# EAGLE design SMT Logic Board (DS3232) (EAGLE 9.6.2)
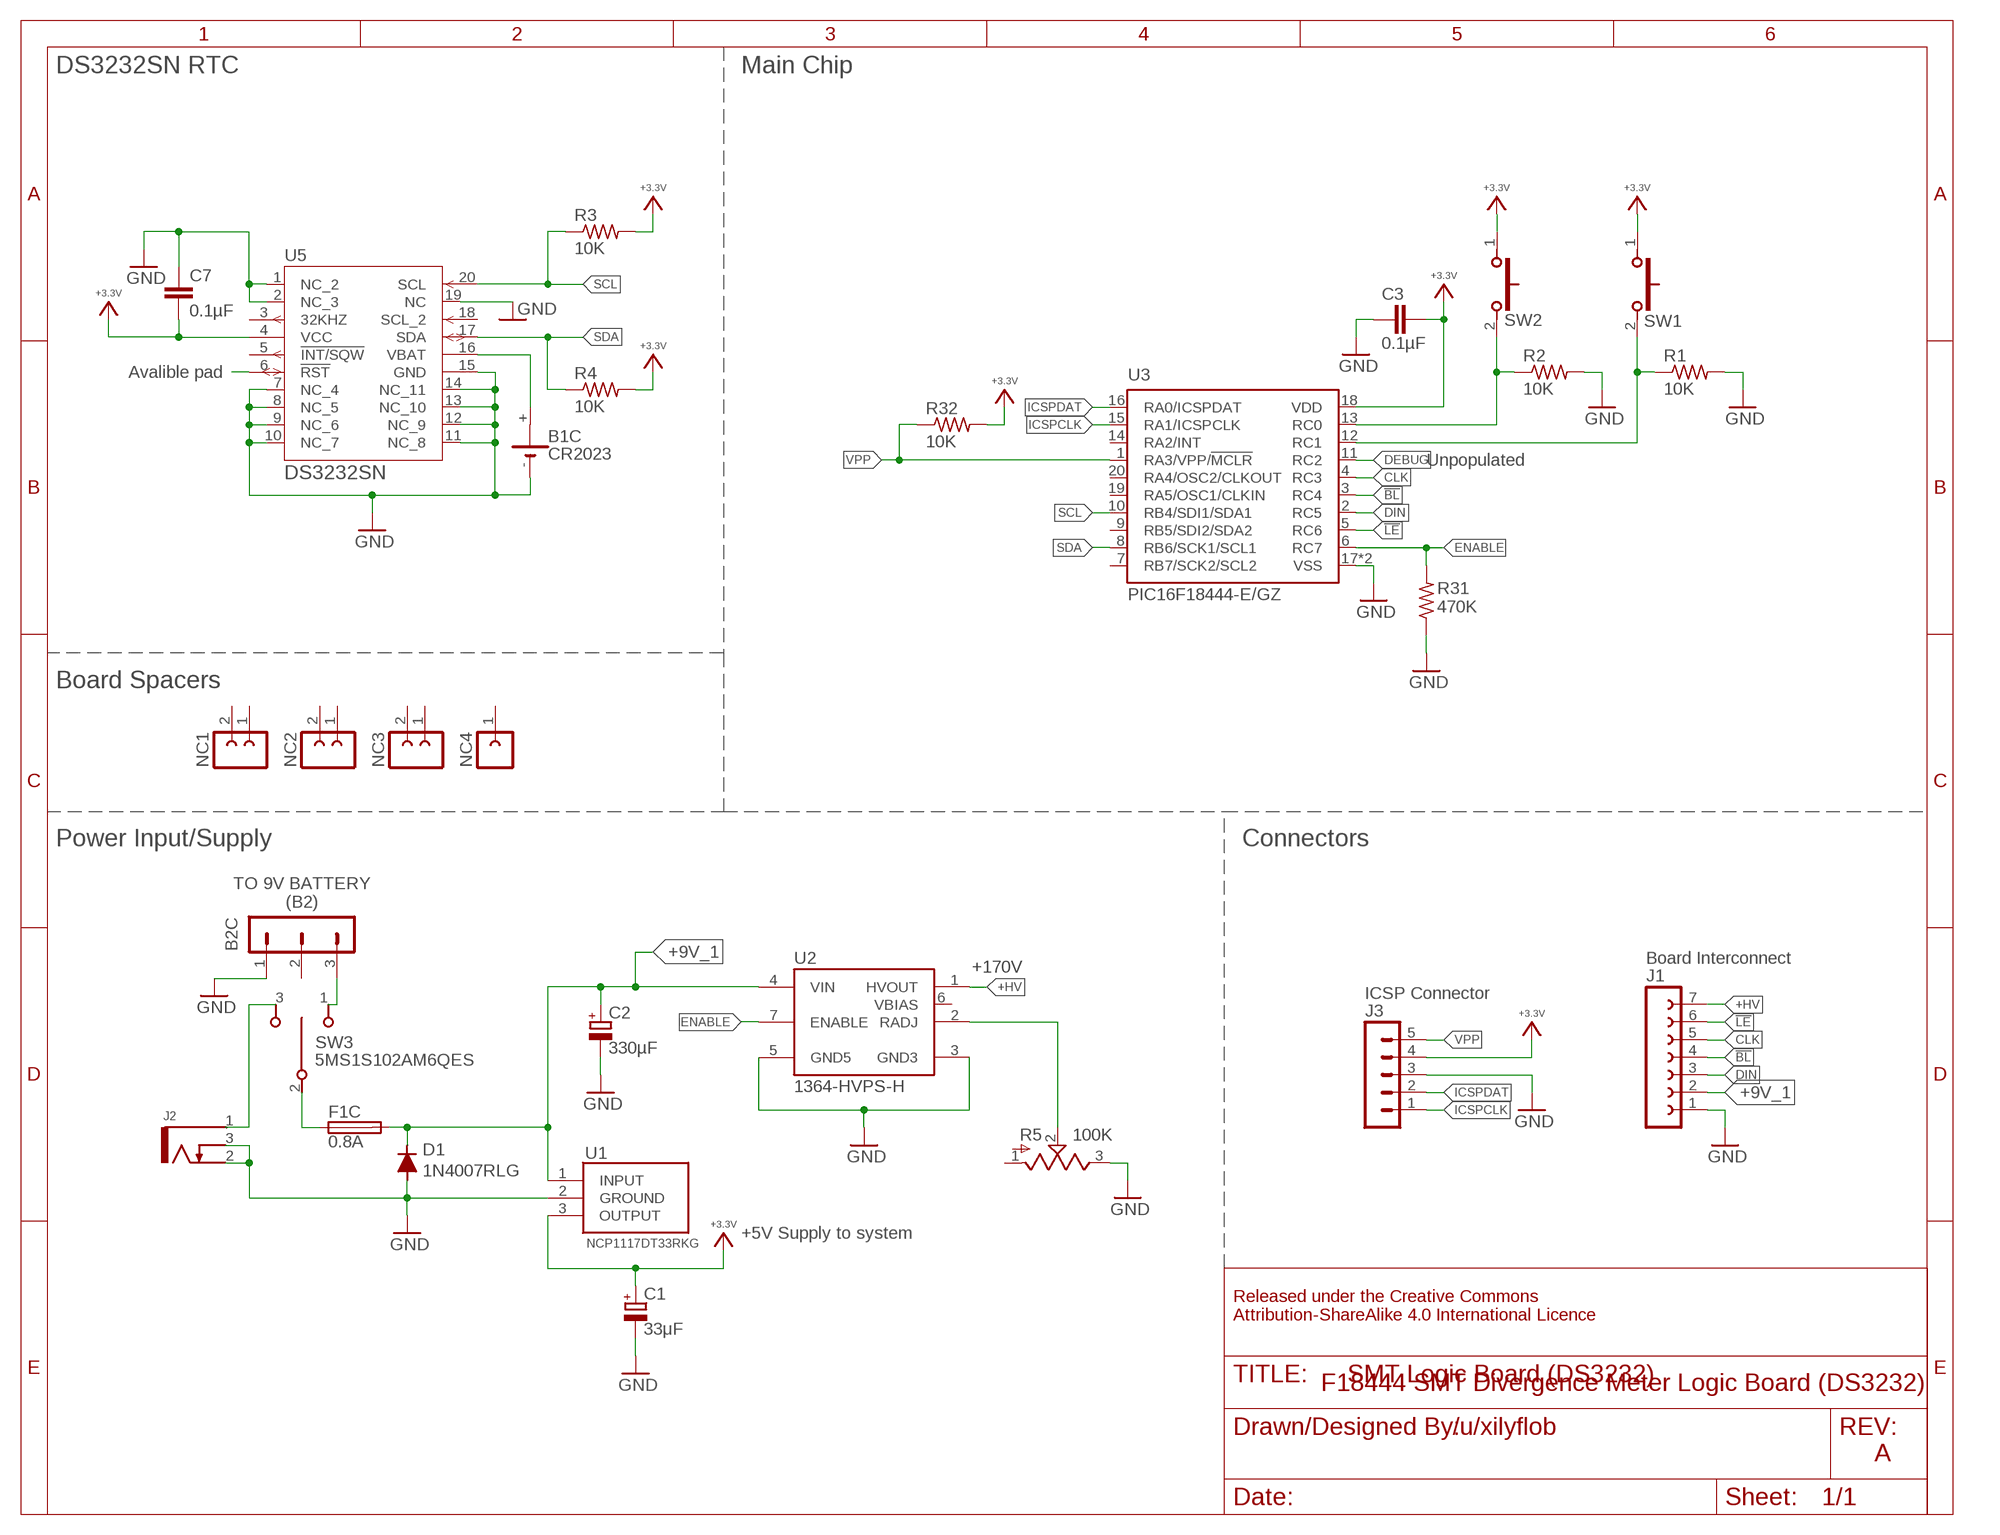
[diagram p0: schematic, sheet 1]

## Parts
B1C  CR2023  BATTERY  [103]
B2C  53253_3P  [532530370]
C1  33μF  CPOL-EU  [4MM_SMD_CHIP]
C2  330µF  CPOL-EU6.3MM_SMD_CHIP  [6.3MM_SMD_CHIP]
C3  0.1µF  C-EU  [C0805]
C7  0.1µF  C-EU  [C0805]
D1  1N4007RLG  RECTIFIERSMA-403D  [SMA-403D]
F1C  0.8A  FUSE  [5X20MM]
J1  FE07FE07  [FE07]
J2  KLDX-0202-B  [KDLX-0202-X]
J3  MA05  [MA05]
NC1  FE02  [FE02]
NC2  FE02  [FE02]
NC3  FE02  [FE02]
NC4  FE01  [FE01]
R1  10K  R-US  [R0805]
R2  10K  R-US  [R0805]
R3  10K  R-US  [R0805]
R4  10K  R-US  [R0805]
R5  100K  R-US_TRIM3224W  [3224W]
R31  470K  R-US  [R0805]
R32  10K  R-US  [R0805]
SW1  FSMRA4JH04  SWITCH_PUSH_SPST_(ON)  [FSMRA4JH]
SW2  FSMRA4JH04  SWITCH_PUSH_SPST_(ON)  [FSMRA4JH]
SW3  5MS1S102AM6QES  SWITCH_SLIDE_SPDT_ON  [SLIDE_SPDT_MINI]
U1  NCP1117DT33RKG  MC7805CTGTO-252-3  [DPAK]
U2  1364-HVPS-H  [1364-HVPS-H]
U3  PIC16F18444-E/GZ  PIC16F184  [UQFN-20]
U5  DS3232SN  [SOIC-20]

## Nets
!BL!: J1.4 U3.3(RC4)
!LE!: J1.6 U3.5(RC6)
+3.3V: C1.+ C3.1 C7.2 J3.4 R3.2 R4.2 R32.2 SW1.1 SW2.1 U1.3(OUTPUT) U3.18(VDD) U5.4(VCC)
+9V: J2.1 SW3.3(POS_2)
+9V_1: C2.+ D1.C F1C.2A F1C.2B J1.2 U1.1(INPUT) U2.4(VIN)
+9V_2: F1C.1A F1C.1B SW3.2(COM)
+9V_3: B2C.3 SW3.1(POS_1)
+HV: J1.7 U2.1(HVOUT)
BAT: B1C.+ U5.16(VBAT)
CLK: J1.5 U3.4(RC3)
CLK_RST: U5.6(!RST)
DEBUG: U3.11(RC2)
DIN: J1.3 U3.2(RC5)
ENABLE: R31.2 U2.7(ENABLE) U3.6(RC7)
GND: B1C.- B2C.1 C1.- C2.- C3.2 C7.1 D1.A J1.1 J2.2 J2.3 J3.3 R1.2 R2.2 R5.3 R31.1 U1.2(GROUND) U2.3(GND3) U2.5(GND5) U3.17(VSS) U3.21(VSS) U5.1(NC_2) U5.2(NC_3) U5.7(NC_4) U5.8(NC_5) U5.9(NC_6) U5.10(NC_7) U5.11(NC_8) U5.12(NC_9) U5.13(NC_10) U5.14(NC_11) U5.15(GND) U5.19(NC)
ICSPCLK: J3.1 U3.15(RA1/ICSPCLK)
ICSPDAT: J3.2 U3.16(RA0/ICSPDAT)
RADJ: R5.2 U2.2(RADJ)
SCL: R3.1 U3.10(RB4/SDI1/SDA1) U5.20(SCL)
SDA: R4.1 U3.8(RB6/SCK1/SCL1) U5.17(SDA)
SW1: R1.1 SW1.2 U3.12(RC1)
SW2: R2.1 SW2.2 U3.13(RC0)
VPP: J3.5 R32.1 U3.1(RA3/VPP/!MCLR!)
Unconnected: B2C.2 NC1.1 NC1.2 NC2.1 NC2.2 NC3.1 NC3.2 NC4.1 R5.1 U2.6(VBIAS) U3.7(RB7/SCK2/SCL2) U3.9(RB5/SDI2/SDA2) U3.14(RA2/INT) U3.19(RA5/OSC1/CLKIN) U3.20(RA4/OSC2/CLKOUT) U5.3(32KHZ) U5.5(!INT/SQW) U5.18(SCL_2)

## Notes on the sheet
- DS3232SN RTC | Main Chip
- Avalible pad
- Unpopulated
- Board Spacers
- Power Input/Supply | Connectors
- TO 9V BATTERY
  (B2)
- Board Interconnect
- +170V
- ICSP Connector
- +5V Supply to system
- Released under the Creative Commons
  Attribution-ShareAlike 4.0 International Licence
- F18444 SMT Divergence Meter Logic Board (DS3232)
- /u/xilyflob
- A

## Library data of the parts
B1C = My Imported Components:BATTERY: LI BATTERY Varta
B2C = My Imported Components:53253_3P: Molex 53253-0370
C1 C2 = My Imported Components:CPOL-EU
C3 C7 = My Imported Components:C-EU
D1 = My Imported Components:RECTIFIER
F1C = My Imported Components:FUSE
J1 = My Imported Components:FE07: FEMALE HEADER
J2 = My Imported Components:KLDX-0202-B: https://www.mouser.com/datasheet/2/222/KLDX_0202-334781.pdf
J3 = My Imported Components:MA05: PIN HEADER
NC1-NC3 = My Imported Components:FE02: FEMALE HEADER
NC4 = My Imported Components:FE01: FEMALE HEADER
R1-R4 R31 R32 = My Imported Components:R-US: RESISTOR, American symbol
R5 = My Imported Components:R-US_TRIM: Res Cermet Trimmer 1M Ohm 10% 1/4W 12(Elec)Turn 1.8mm (6.4 X 4 X 7.7mm) Pin Thru-Hole Bulk Check prices <https://pricing.snapeda.com/parts/PV37W104C01B00/Bourns/view-part?ref=eda>
SW1 SW2 = My Imported Components:SWITCH_PUSH_SPST_(ON)
SW3 = My Imported Components:SWITCH_SLIDE_SPDT_ON
U1 = My Imported Components:MC7805CTG: Voltage regulator,MC7805CT 5V 1A ON Semiconductor MC7805CTG, Single Linear Voltage Regulator, 1A 5 V, +/-4%, 3-Pin TO-220 Source: Datasheet <http://www.onsemi.com/pub/Collateral/MC7800-D.PDF>
U2 = My Imported Components:1364-HVPS-H: https://www.shop-tes.com/content/Datasheets/8002K.pdf
U3 = My Imported Components:PIC16F184*
U5 = My Imported Components:DS3232SN; BUILT_BY: EMA_UL_Team; MANUFACTURER_PART_NUMBER: ds3232sn#; SOURCELIBRARY: Maxim_2009-12-17_1; VENDOR: Maxim Integrated Products

## Board
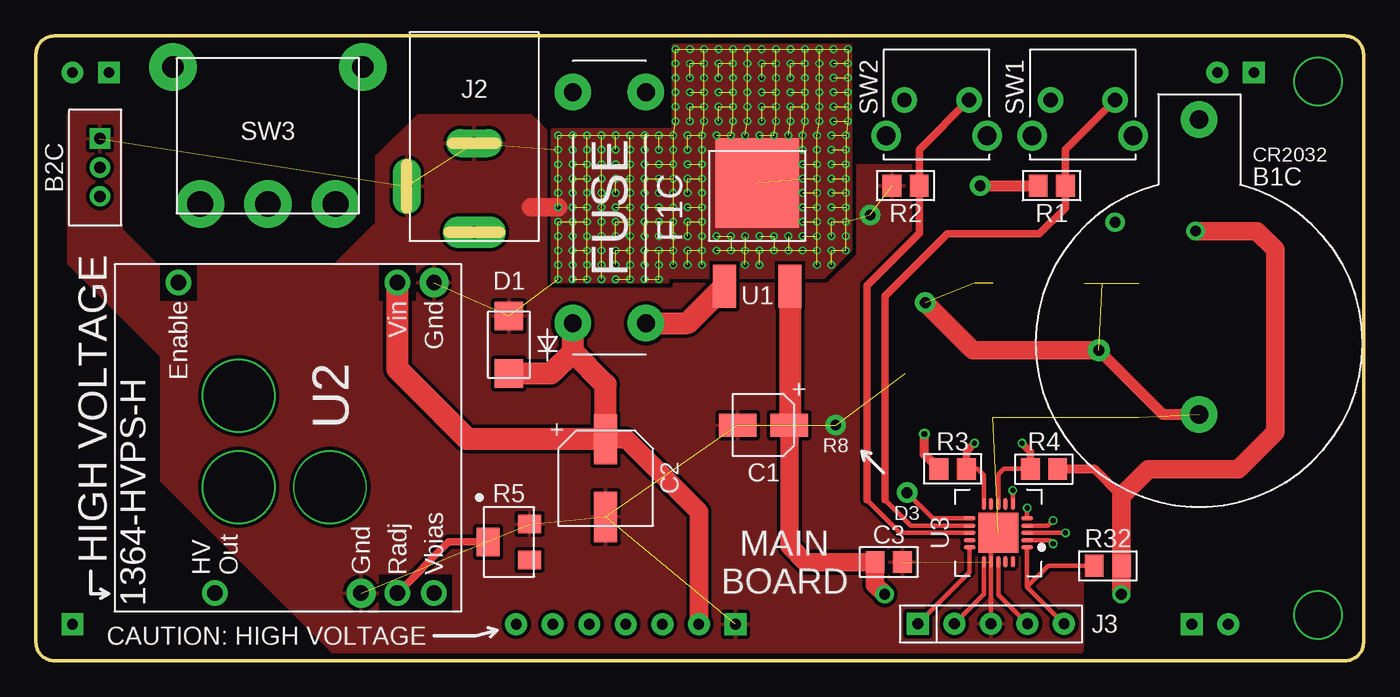
[diagram p1: board, top side]
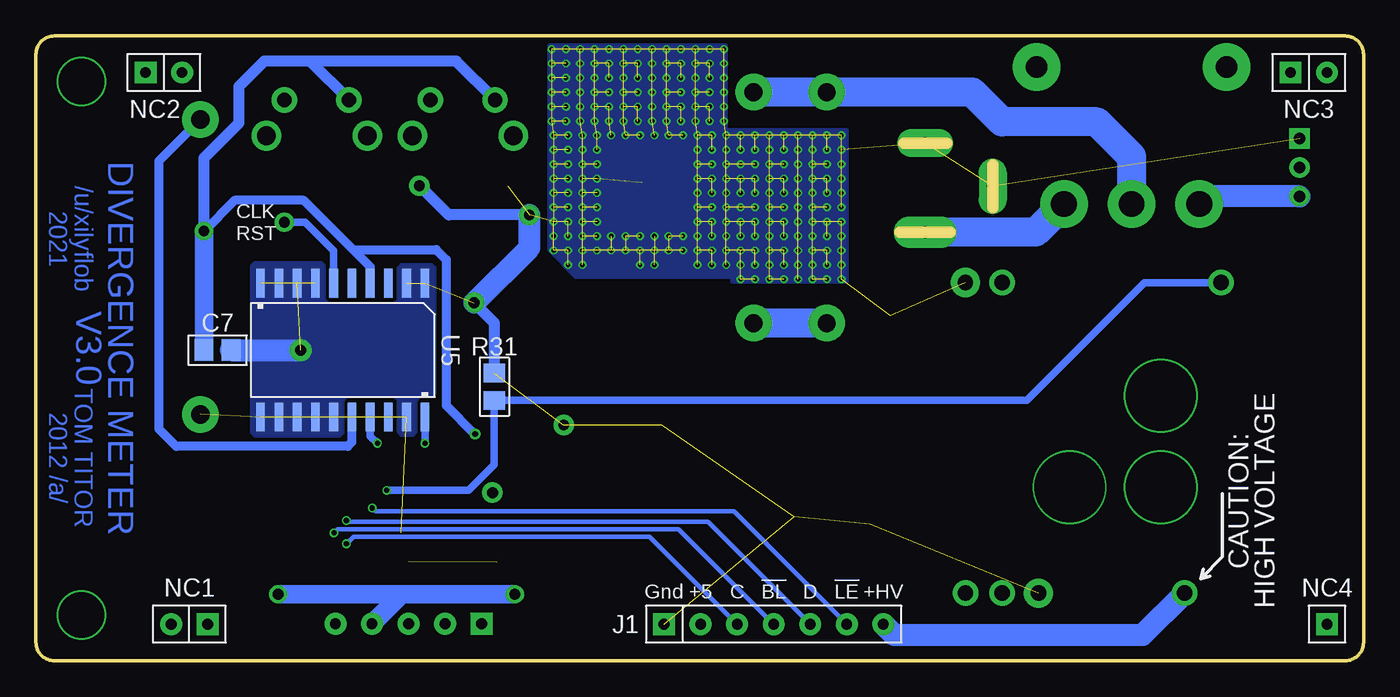
[diagram p2: board, bottom side, seen from below]

Size 92.33 x 43.43 mm. Coordinates in mm from the lower left corner, seen from the top.
Outline: 92.33,1.27 92.33,42.16 arc90 91.06,43.43 1.27,43.43 arc90 0,42.16 0,1.27 arc90 1.27,0 91.06,0 arc90 92.33,1.27
Copper layers (1*16): Top 0.035559375mm / dielectric 1.6mm / Bottom 0.035559375mm
Design rules "oshpark-2layer *": minimum track width 6mil, minimum drill 10mil, track to track 6mil, track to pad 6mil, pad to pad 6mil, via to via 6mil, smd to smd 6mil, copper to edge 15mil, drill to drill 6mil, minimum pad ring 5mil, minimum via ring 5mil, stop-mask expansion 2.5mil, vias tented up to drill 30mil, thermal gap 10mil

### Footprints (pad centres in the part's own frame; a part is rotated, then mirrored left to right if it is on the bottom)
103 = drill 1.27 pad 2.54: + 0,0; - 0,-20.498
532530370 = drill 0.8 pad 1.422 square: 1 -2,0 | drill 0.8 pad 1.422: 2 0,0; 3 2,0
4MM_SMD_CHIP = smd 2.6 x 1.6: + 1.8,0; - -1.8,0
6.3MM_SMD_CHIP = smd 3.5 x 1.6: + 2.7,0; - -2.7,0
C0805 = smd 1.3 x 1.5: 1 -0.95,0; 2 0.95,0
SMA-403D = smd 2 x 2: A 2,0; C -2,0
5X20MM = drill 1.245 pad 2.54: 1A -8.026,2.54; 1B -8.026,-2.54; 2A 8.026,2.54; 2B 8.026,-2.54
FE07 = drill 0.75 pad 1.524 square: 1 -7.62,0 | drill 0.75 pad 1.524: 2 -5.08,0; 3 -2.54,0; 4 0,0; 5 2.54,0; 6 5.08,0; 7 7.62,0
KDLX-0202-X = drill 0.8 pad 2.184 long: 1 13.9,0 | drill 0.8 pad 1.93 long: 2 7.7,0; 3 10.7,-4.7
MA05 = drill 0.75 pad 1.524 square: 1 -6.35,0 | drill 0.75 pad 1.524: 2 -3.81,0; 3 -1.27,0; 4 1.27,0; 5 3.81,0
FE02 = drill 0.75 pad 1.524 square: 1 -1.27,0 | drill 0.75 pad 1.524: 2 1.27,0
FE01 = drill 0.75 pad 1.524 square: 1 0,0
R0805 = smd 1.3 x 1.5: 1 -0.95,0; 2 0.95,0
3224W = smd 1.6 x 1.3: 1 1.45,-1.25; 3 1.45,1.25 | smd 1.6 x 2: 2 -1.45,0
FSMRA4JH = drill 0.991 pad 1.753: 1 4.496,0; 2 0,0 | drill 1.295 pad 2.057: 3 -1.245,2.489; 4 5.766,2.489
SLIDE_SPDT_MINI = drill 1.8 pad 3.302: 1 -4.699,0; 2 0,0; 3 4.699,0 | drill 1.5 pad 3.302: P$4 -6.604,9.525; P$5 6.604,9.525
DPAK = smd 3 x 1.6: 1 0,-2.285; 3 0,2.285 | smd 6.2 x 5.8: 2 -7.18,0
1364-HVPS-H = drill 1.067 pad 1.778: 1 1.27,17.145; 2 1.27,4.445; 4 22.86,4.445; 6 1.27,1.905; 7 22.86,19.685 | drill 1.067 pad 2.032: 3 1.27,6.985; 5 22.86,1.905
UQFN-20 = smd 0.8 x 0.3: 1 -2,1; 2 -2,0.5; 3 -2,0; 4 -2,-0.5; 5 -2,-1; 11 2,-1; 12 2,-0.5; 13 2,0; 14 2,0.5; 15 2,1 | smd 0.3 x 0.8: 6 -1,-2; 7 -0.5,-2; 8 0,-2; 9 0.5,-2; 10 1,-2; 16 1,2; 17 0.5,2; 18 0,2; 19 -0.5,2; 20 -1,2 | smd 2.8 x 2.8: 21 0,0
SOIC-20 = smd 2 x 0.6: 1 -4.65,5.715; 2 -4.65,4.445; 3 -4.65,3.175; 4 -4.65,1.905; 5 -4.65,0.635; 6 -4.65,-0.635; 7 -4.65,-1.905; 8 -4.65,-3.175; 9 -4.65,-4.445; 10 -4.65,-5.715; 11 4.65,-5.715; 12 4.65,-4.445; 13 4.65,-3.175; 14 4.65,-1.905; 15 4.65,-0.635; 16 4.65,0.635; 17 4.65,1.905; 18 4.65,3.175; 19 4.65,4.445; 20 4.65,5.715

### Placement (x,y rotation side)
B1C  80.9,37.62 0 top
B2C  4.45,34.29 270 top
C1  50.6,16.38 0 top
C2  39.62,12.7 90 top
C3  59.31,6.86 0 top
C7  79.71,21.59 180 bottom
D1  32.89,21.97 90 top
F1C  39.88,31.5 270 top
J1  41.02,2.54 0 bottom
J2  30.48,43.69 270 top
J3  67.69,2.57 0 top
NC1  81.66,2.54 180 bottom
NC2  83.44,40.89 0 bottom
NC3  3.81,40.89 0 bottom
NC4  2.54,2.54 0 bottom
R1  70.64,33.02 180 top
R2  60.48,33.02 180 top
R3  63.75,13.34 180 top
R4  70.1,13.34 0 top
R5  32.89,8.26 0 top
R31  60.45,19.05 270 bottom
R32  74.55,6.6 0 top
SW1  75.06,38.99 180 top
SW2  64.9,38.99 180 top
SW3  16.13,31.75 0 top
U1  50.16,26.04 270 top
U2  29.59,3.43 90 top
U3  66.93,8.89 180 top
U5  70.99,21.59 270 bottom

### Tracks (layer width: path | path; a pad name or v marks a point on that pad's centre or on a via)
!BL!  (via drill 0.35)
  Top 0.3: U3.3 v71.6,8.89
  Bottom 0.3: v71.6,8.89 71.35,9.14 47.62,9.14 J1.4
!LE!  (via drill 0.35)
  Top 0.3: U3.5 v68.93,10.61 v68.94,10.62
  Bottom 0.3: v68.94,10.62 68.71,10.39 43.79,10.39 J1.6
+3.3V  (via drill 0.4 pad 0.75, 0.75 pad 1.27)
  Top 0.3: J3.4 66.93,4.6 U3.18
  Top 0.635: v61.78,15.76 61.78,14.35 R3.2 | R4.2 73.6,13.34 75.5,11.44
  Top 1.27: v80.64,29.87 84.91,29.87 86.18,28.6 86.18,15.88 83.62,13.31 77.37,13.31 75.5,11.44 R32.2 v75.5,4.62 v75.49,4.62 | C1.+ 52.4,7.98 53.52,6.86 C3.1 58.36,5.29 v59.03,4.62
  Top 1.524: U1.3 52.45,16.44 C1.+
  Bottom 0.635: v80.64,29.87 78.51,32 73.71,32 70.28,28.57 | 70.28,28.57 69.09,27.38 U5.4 | 70.28,28.57 64.49,28.57 63.8,27.89 63.8,17.75 61.81,15.76 v61.78,15.76
  Bottom 0.762: v80.64,29.87 80.64,34.95 78.21,37.39 78.21,39.93 76.45,41.68 73.25,41.68 | SW2.1 63.09,41.68 73.25,41.68 | SW1.1 73.25,41.68
  Bottom 1.27: v59.03,4.62 66.9,4.62 | 66.9,4.62 v75.49,4.62 | J3.4 66.9,4.62 | v80.64,29.87 80.64,21.6 C7.2
+9V
  Bottom 2.032: SW3.3 22.79,29.79 J2.1
+9V_1
  Top 1.27: C2.+ 41.06,15.4 46.1,10.36 J1.2
  Top 1.524: U2.4 25.15,20.27 30.02,15.4 C2.+ 39.62,19.2 37.34,21.49 | F1C.2A 45.31,23.47 U1.1 | D1.C 35.82,19.97 37.34,21.49 | 37.34,21.49 F1C.2B
  Bottom 2.032: F1C.2B F1C.2A
+9V_2
  Bottom 2.032: F1C.1A F1C.1B 27.2,39.52 25.15,37.47 18.54,37.47 16.13,35.05 SW3.2
+9V_3
  Bottom 1.524: B2C.3 10.89,32.29 SW3.1
+HV
  Bottom 1.524: U2.1 15.37,1.78 32.64,1.78 J1.7
BAT
  Bottom 0.635: B1C.+ 83.77,34.75 83.77,16.1 82.58,14.91 70.64,14.91 70.36,15.19 U5.16
CLK  (via drill 0.35)
  Top 0.3: U3.4 70.38,9.39 v70.74,9.75
  Bottom 0.3: v70.74,9.75 70.64,9.65 45.59,9.65 J1.5
CLK_RST  (via drill 0.75 pad 1.35)
  Bottom 0.508: v75.06,30.48 73.61,30.48 71.63,28.5 U5.6
DEBUG  (via drill 0.75 pad 1.42)
  Top 0.3: U3.11 62.37,9.89 v60.58,11.68
DIN  (via drill 0.35)
  Top 0.3: U3.2 70.48,8.39 v70.74,8.13
  Bottom 0.3: v70.74,8.13 70.23,8.64 49.66,8.64 J1.3
ENABLE  (via drill 0.35)
  Top 0.3: U3.6 v67.93,11.84 67.93,11.85
  Bottom 0.508: v67.93,11.84 62.26,11.84 60.45,13.64 R31.2 23.43,18.1 15.24,26.29 U2.7
GND  (via drill 0.3, 0.75 pad 1.42, 0.75 pad 1.52)  (281 unrouted)
  Top 0.3: J3.3 U3.17 66.43,7.73 66.93,8.23 U3.21
  Top 0.762: v65.66,33.02 R1.2 | v73.91,21.59 78.38,17.12 B1C.-
  Top 1.27: v61.85,24.89 65.15,21.59 v73.91,21.59 | v36.32,31.52 34.44,31.52
  Bottom 0.762: v58.01,30.99 63.63,30.99 v65.66,33.02 | v61.85,24.89 60.45,23.5 R31.1
  Bottom 1.524: v61.85,24.89 58.01,28.73 v58.01,30.99 | C7.1 v73.91,21.59
  other vias: 55.63,16.38 44.48,42.52 45.48,42.52 46.48,42.52 47.48,42.52 48.48,42.52 49.48,42.52 50.48,42.52 51.48,42.52 52.48,42.52 53.48,42.52 54.48,42.52 55.48,42.52 56.48,42.52 44.48,41.52 45.48,41.52 46.48,41.52 47.48,41.52 48.48,41.52 49.48,41.52 50.48,41.52 51.48,41.52 52.48,41.52 53.48,41.52 54.48,41.52 55.48,41.52 56.48,41.52 44.48,40.52 45.48,40.52 46.48,40.52 47.48,40.52 48.48,40.52 49.48,40.52 50.48,40.52 51.48,40.52 52.48,40.52 53.48,40.52 54.48,40.52 55.48,40.52 56.48,40.52 44.48,39.52 45.48,39.52 46.48,39.52 47.48,39.52 48.48,39.52 49.48,39.52 50.48,39.52 51.48,39.52 52.48,39.52 53.48,39.52 54.48,39.52 55.48,39.52 56.48,39.52 44.48,38.52 45.48,38.52 46.48,38.52 47.48,38.52 48.48,38.52 49.48,38.52 50.48,38.52 51.48,38.52 52.48,38.52 53.48,38.52 54.48,38.52 55.48,38.52 56.48,38.52 44.48,37.52 45.48,37.52 46.48,37.52 47.48,37.52 48.48,37.52 49.48,37.52 50.48,37.52 51.48,37.52 52.48,37.52 53.48,37.52 54.48,37.52 55.48,37.52 56.48,37.52 44.32,36.52 45.32,36.52 46.32,36.52 47.32,36.52 48.32,36.52 49.32,36.52 50.32,36.52 51.32,36.52 52.32,36.52 53.32,36.52 54.32,36.52 55.32,36.52 56.32,36.52 44.32,35.52 45.32,35.52 46.32,35.52 54.32,35.52 55.32,35.52 56.32,35.52 44.32,34.52 45.32,34.52 46.32,34.52 54.32,34.52 55.32,34.52 56.32,34.52 44.32,33.52 45.32,33.52 46.32,33.52 54.32,33.52 55.32,33.52 56.32,33.52 44.32,32.52 45.32,32.52 46.32,32.52 54.32,32.52 55.32,32.52 56.32,32.52 44.32,31.52 45.32,31.52 46.32,31.52 54.32,31.52 55.32,31.52 56.32,31.52 44.32,30.52 45.32,30.52 46.32,30.52 54.32,30.52 55.32,30.52 56.32,30.52 44.32,29.52 45.32,29.52 46.32,29.52 54.32,29.52 55.32,29.52 56.32,29.52 44.32,28.52 45.32,28.52 46.32,28.52 47.32,28.52 48.32,28.52 49.32,28.52 50.32,28.52 51.32,28.52 52.32,28.52 53.32,28.52 54.32,28.52 55.32,28.52 56.32,28.52 44.32,27.52 45.32,27.52 46.32,27.52 49.32,27.52 50.32,27.52 54.32,27.52 55.32,27.52 36.32,36.52 37.32,36.52 38.32,36.52 39.32,36.52 40.32,36.52 41.32,36.52 42.32,36.52 43.32,36.52 36.32,35.52 37.32,35.52 38.32,35.52 39.32,35.52 40.32,35.52 41.32,35.52 42.32,35.52 43.32,35.52 36.32,34.52 37.32,34.52 38.32,34.52 39.32,34.52 40.32,34.52 41.32,34.52 42.32,34.52 43.32,34.52 36.32,33.52 37.32,33.52 38.32,33.52 39.32,33.52 40.32,33.52 41.32,33.52 42.32,33.52 43.32,33.52 36.32,32.52 37.32,32.52 38.32,32.52 39.32,32.52 40.32,32.52 41.32,32.52 42.32,32.52 43.32,32.52 37.32,31.52 38.32,31.52 39.32,31.52 40.32,31.52 41.32,31.52 42.32,31.52 43.32,31.52 36.32,30.52 37.32,30.52 38.32,30.52 39.32,30.52 40.32,30.52 41.32,30.52 42.32,30.52 43.32,30.52 36.32,29.52 37.32,29.52 38.32,29.52 39.32,29.52 40.32,29.52 41.32,29.52 42.32,29.52 43.32,29.52 36.32,28.52 37.32,28.52 38.32,28.52 39.32,28.52 40.32,28.52 41.32,28.52 42.32,28.52 43.32,28.52 36.32,27.52 37.32,27.52 38.32,27.52 39.32,27.52 40.32,27.52 41.32,27.52 42.32,27.52 43.32,27.52 36.32,26.52 37.32,26.52 38.32,26.52 39.32,26.52 40.32,26.52 41.32,26.52 42.32,26.52 43.32,26.52 53.32,35.52 53.32,34.52 53.32,33.52 53.32,32.52 53.32,31.52 53.32,30.52 53.32,29.52 47.32,29.52 48.32,29.52 49.32,29.52 50.32,29.52 51.32,29.52 52.32,29.52
  pour Bottom (no thermals): 64.57,27.36 64.57,18.59 64.82,18.34 65.63,18.34 65.89,18.08 65.89,15.88 66.14,15.62 66.9,15.62 67.16,15.88 67.16,18.08 67.41,18.34 70.71,18.34 70.97,18.08 70.97,15.82 71.22,15.57 77.11,15.57 77.37,15.82 77.37,27.48 77.11,27.74 72.49,27.74 72.24,27.48 72.24,25.12 71.98,24.87 67.41,24.87 67.16,25.12 67.16,27.36 66.9,27.61 64.82,27.61
  cutout Top: 23.88,3.43 23.88,5.97 28.96,5.97 28.96,3.43
  cutout Top: 23.88,25.02 23.88,27.56 26.42,27.56 26.42,25.02
  cutout Top: 8.64,25.02 8.64,27.56 11.18,27.56 11.18,25.02
  cutout Top: 10.54,2.79 10.54,6.6 14.35,6.6 14.35,2.79
  pour Top (isolate 0.254, rank 2): 8.74,12.52 8.74,21.18 2.29,27.64 2.29,38.02 2.57,38.3 5.69,38.3 5.94,38.05 5.94,29.95 8.53,27.36 20.62,27.36 23.7,30.43 23.7,35.03 26.57,37.9 34.42,37.9 35.43,36.88 35.43,25.83 44.42,25.83 44.42,26.16 55.09,26.16 57.15,28.22 57.15,34.42 61.39,34.42 61.39,29.67 57.81,26.09 57.81,11.2 72.52,11.2 72.77,10.95 72.77,0.71 72.52,0.46 20.8,0.46
  pour Top (no thermals): 44.32,42.8 44.32,36.9 35.94,36.9 35.94,26.34 43.92,26.34 43.92,26.67 54.79,26.67 56.64,28.52 56.64,42.8
  pour Bottom (no thermals): 44.32,42.8 44.32,36.9 35.94,36.9 35.94,26.34 43.92,26.34 43.92,26.67 54.79,26.67 56.64,28.52 56.64,42.8
  cutout Top (no thermals): 46.84,26.52 48.92,26.52 48.92,27.79 46.84,27.79
GND2
  cutout Top (no thermals): 51.41,26.52 53.49,26.52 53.49,27.79 51.41,27.79
ICSPCLK
  Top 0.3: U3.15 64.93,6.15 J3.1
ICSPDAT
  Top 0.3: U3.16 65.93,4.61 J3.2
N$1  (via drill 3.17)
  other vias: 89.15,3.17
N$12  (via drill 3.17)
  other vias: 89.15,40.26
N$28  (via drill 4.88)
  other vias: 14.1,12.06
N$29  (via drill 4.88)
  other vias: 14.1,18.41
N$30  (via drill 4.88)
  other vias: 20.45,12.06
RADJ
  Top 0.508: U2.2 28.7,8.26 R5.2
SCL  (via drill 0.35)
  Top 0.3: R3.1 65.48,13.34 65.93,12.89 U3.10
  Top 0.508: v65.28,15.11 64.7,14.54 R3.1
  Bottom 0.508: U5.20 v65.28,15.11
SDA  (via drill 0.35)
  Top 0.3: R4.1 67.31,13.34 66.93,12.95 U3.8
  Top 0.508: v68.58,15.11 69.15,14.54 R4.1
  Bottom 0.508: U5.17 69.09,15.62 v68.58,15.11
SW1
  Top 0.3: U3.12 60.84,9.39 59.05,11.18
  Top 0.508: SW1.2 71.59,35.52 R1.1 71.59,31.45 69.8,29.67 63.4,29.67 59.05,25.32 59.05,11.18
SW2
  Top 0.3: 57.78,11.18 60.07,8.89 U3.13
  Top 0.508: SW2.2 61.43,35.52 R2.1 61.43,29.7 57.78,26.06 57.78,11.18
VPP
  Top 0.3: J3.5 68.93,5.14 | 68.93,5.14 U3.1 | R32.1 70.4,6.6 68.93,5.14

### Text on the board
Bottom: /u/xilyflob / 2021 | DIVERGENCE METER / V3.0 | TOM TITOR / 2012 /a/
tPlace: CR2032 | R8 | D3 | HIGH VOLTAGE | MAIN / BOARD | CAUTION: HIGH VOLTAGE
bPlace: CLK / RST | CAUTION: / HIGH VOLTAGE | +HV | !LE! | D | !BL! | C | +5 | Gnd
bStop: /u/xilyflob / 2021 | DIVERGENCE METER / V3.0 | TOM TITOR / 2012 /a/